# Altium schematic sheet MainSheet.SchDoc
size A; SheetNumber: 1; SheetTotal: 4
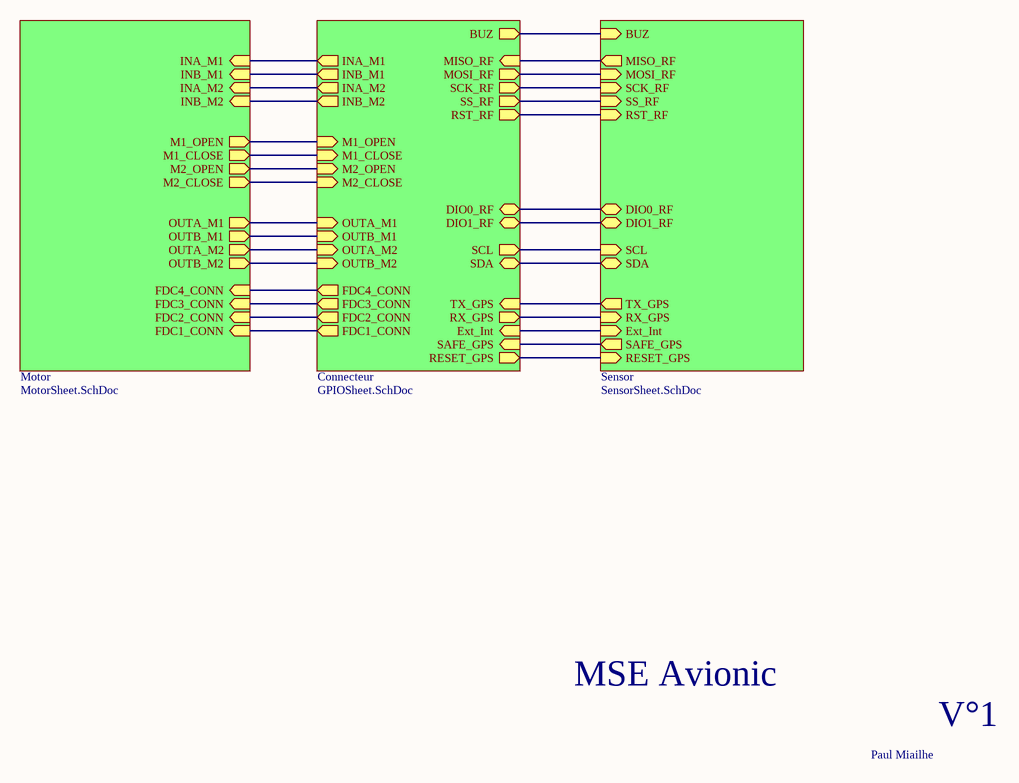
[diagram p0: MainSheet.SchDoc]

## Sub-sheets
Connecteur = GPIOSheet.SchDoc: OUTA_M1 (in), OUTB_M1 (in), OUTA_M2 (in), OUTB_M2 (in), FDC1_CONN (out), FDC2_CONN (out), FDC3_CONN (out), FDC4_CONN (out), SDA (bidir), INA_M1 (out), INB_M1 (out), INA_M2 (out), INB_M2 (out), SCL (out), M1_OPEN (in), M1_CLOSE (in), M2_OPEN (in), M2_CLOSE (in), BUZ (out), SS_RF (out), MISO_RF (in), MOSI_RF (out), SCK_RF (out), RST_RF (out), TX_GPS (in), RX_GPS (out), Ext_Int (in), DIO0_RF (bidir), DIO1_RF (bidir), SAFE_GPS (in), RESET_GPS (out)
Motor = MotorSheet.SchDoc: M1_OPEN (out), M1_CLOSE (out), M2_CLOSE (out), M2_OPEN (out), OUTA_M1 (out), OUTB_M1 (out), OUTA_M2 (out), OUTB_M2 (out), FDC1_CONN (in), FDC2_CONN (in), FDC3_CONN (in), FDC4_CONN (in), INA_M1 (in), INB_M1 (in), INA_M2 (in), INB_M2 (in)
Sensor = SensorSheet.SchDoc: BUZ (in), SCK_RF (in), DIO1_RF (bidir), MISO_RF (out), MOSI_RF (in), SS_RF (in), RST_RF (in), DIO0_RF (bidir), RX_GPS (in), Ext_Int (in), TX_GPS (out), SCL (in), SDA (bidir), SAFE_GPS (out), RESET_GPS (in)

## Nets
(unnamed): sheet Motor/M1_OPEN, sheet Connecteur/M1_OPEN
(unnamed): sheet Motor/M1_CLOSE, sheet Connecteur/M1_CLOSE
(unnamed): sheet Motor/M2_CLOSE, sheet Connecteur/M2_CLOSE
(unnamed): sheet Motor/M2_OPEN, sheet Connecteur/M2_OPEN
(unnamed): sheet Motor/OUTA_M1, sheet Connecteur/OUTA_M1
(unnamed): sheet Motor/OUTB_M1, sheet Connecteur/OUTB_M1
(unnamed): sheet Motor/OUTA_M2, sheet Connecteur/OUTA_M2
(unnamed): sheet Motor/OUTB_M2, sheet Connecteur/OUTB_M2
(unnamed): sheet Motor/FDC1_CONN, sheet Connecteur/FDC1_CONN
(unnamed): sheet Motor/FDC2_CONN, sheet Connecteur/FDC2_CONN
(unnamed): sheet Motor/FDC3_CONN, sheet Connecteur/FDC3_CONN
(unnamed): sheet Motor/FDC4_CONN, sheet Connecteur/FDC4_CONN
(unnamed): sheet Motor/INA_M1, sheet Connecteur/INA_M1
(unnamed): sheet Motor/INB_M1, sheet Connecteur/INB_M1
(unnamed): sheet Motor/INA_M2, sheet Connecteur/INA_M2
(unnamed): sheet Motor/INB_M2, sheet Connecteur/INB_M2
(unnamed): sheet Sensor/BUZ, sheet Connecteur/BUZ
(unnamed): sheet Sensor/SCK_RF, sheet Connecteur/SCK_RF
(unnamed): sheet Sensor/DIO1_RF, sheet Connecteur/DIO1_RF
(unnamed): sheet Sensor/MISO_RF, sheet Connecteur/MISO_RF
(unnamed): sheet Sensor/MOSI_RF, sheet Connecteur/MOSI_RF
(unnamed): sheet Sensor/SS_RF, sheet Connecteur/SS_RF
(unnamed): sheet Sensor/RST_RF, sheet Connecteur/RST_RF
(unnamed): sheet Sensor/DIO0_RF, sheet Connecteur/DIO0_RF
(unnamed): sheet Sensor/RX_GPS, sheet Connecteur/RX_GPS
(unnamed): sheet Sensor/Ext_Int, sheet Connecteur/Ext_Int
(unnamed): sheet Sensor/TX_GPS, sheet Connecteur/TX_GPS
(unnamed): sheet Sensor/SCL, sheet Connecteur/SCL
(unnamed): sheet Sensor/SDA, sheet Connecteur/SDA
(unnamed): sheet Sensor/SAFE_GPS, sheet Connecteur/SAFE_GPS
(unnamed): sheet Sensor/RESET_GPS, sheet Connecteur/RESET_GPS

## Notes on the sheet
- MSE Avionic
- V°1
- Paul Miailhe